# Altium schematic sheet electrical_interface.SchDoc: Electrical Interface
size A4; Author: AJ; DrawnBy: AJ; Engineer: AJ; DocumentNumber: 5; Revision: 005; SheetNumber: 5; SheetTotal: 6; Description: Interface to optocouplers on the external system.
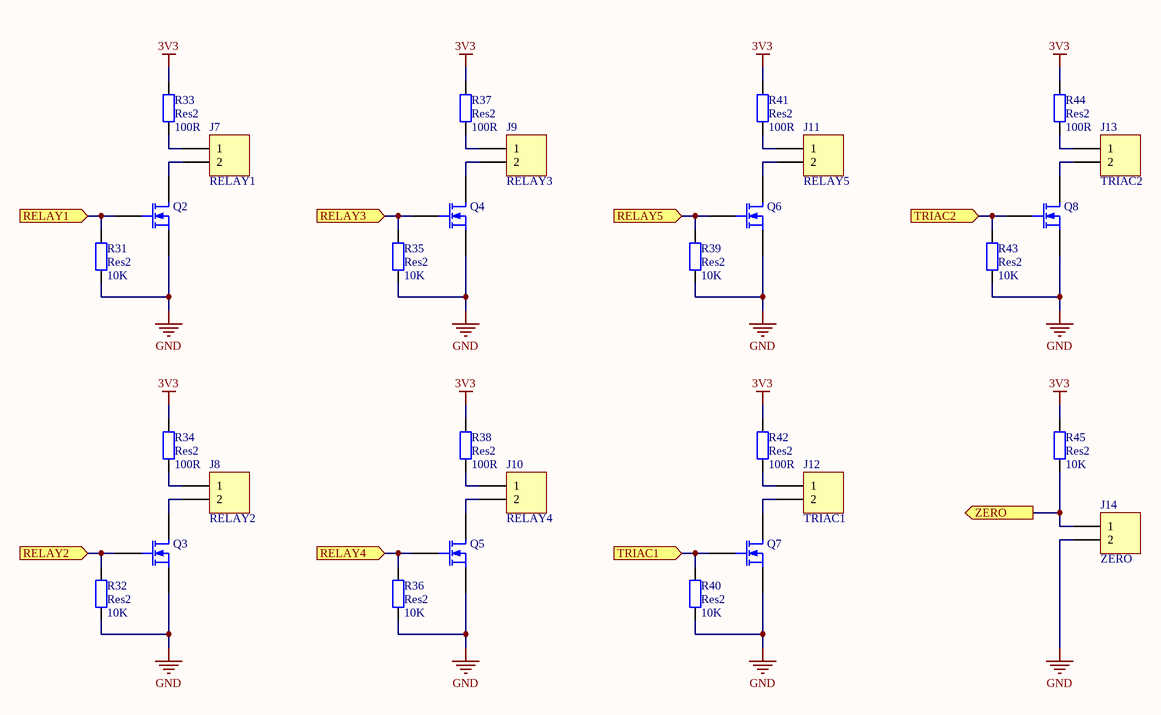
[diagram p0: electrical_interface.SchDoc]

## Parts
J7  RELAY1  [Terminal Block]
J8  RELAY2  [Terminal Block]
J9  RELAY3  [Terminal Block]
J10  RELAY4  [Terminal Block]
J11  RELAY5  [Terminal Block]
J12  TRIAC1  [Terminal Block]
J13  TRIAC2  [Terminal Block]
J14  ZERO  [Terminal Block]
Q2  MOSFET-N  [SOT323]  (value not drawn)
Q3  MOSFET-N  [SOT323]  (value not drawn)
Q4  MOSFET-N  [SOT323]  (value not drawn)
Q5  MOSFET-N  [SOT323]  (value not drawn)
Q6  MOSFET-N  [SOT323]  (value not drawn)
Q7  MOSFET-N  [SOT323]  (value not drawn)
Q8  MOSFET-N  [SOT323]  (value not drawn)
R31  Res2  value 10K  [0603]
R32  Res2  value 10K  [0603]
R33  Res2  value 100R  [0603]
R34  Res2  value 100R  [0603]
R35  Res2  value 10K  [0603]
R36  Res2  value 10K  [0603]
R37  Res2  value 100R  [0603]
R38  Res2  value 100R  [0603]
R39  Res2  value 10K  [0603]
R40  Res2  value 10K  [0603]
R41  Res2  value 100R  [0603]
R42  Res2  value 100R  [0603]
R43  Res2  value 10K  [0603]
R44  Res2  value 100R  [0603]
R45  Res2  value 10K  [0603]

## Ports
RELAY1 (in), RELAY2 (in), RELAY3 (in), RELAY4 (in), RELAY5 (in), TRIAC1 (in), TRIAC2 (in), ZERO (out)

## Nets
3V3: R33.2 R34.2 R37.2 R38.2 R41.2 R42.2 R44.2 R45.2
GND: J14.2 Q2.3(S) Q3.3(S) Q4.3(S) Q5.3(S) Q6.3(S) Q7.3(S) Q8.3(S) R31.1 R32.1 R35.1 R36.1 R39.1 R40.1 R43.1
RELAY1: Q2.2(G) R31.2 ; port RELAY1
RELAY2: Q3.2(G) R32.2 ; port RELAY2
RELAY3: Q4.2(G) R35.2 ; port RELAY3
RELAY4: Q5.2(G) R36.2 ; port RELAY4
RELAY5: Q6.2(G) R39.2 ; port RELAY5
TRIAC1: Q7.2(G) R40.2 ; port TRIAC1
TRIAC2: Q8.2(G) R43.2 ; port TRIAC2
ZERO: J14.1 R45.1 ; port ZERO
NetJ7_1: J7.1 R33.1
NetJ7_2: J7.2 Q2.1(D)
NetJ8_1: J8.1 R34.1
NetJ8_2: J8.2 Q3.1(D)
NetJ9_1: J9.1 R37.1
NetJ9_2: J9.2 Q4.1(D)
NetJ10_1: J10.1 R38.1
NetJ10_2: J10.2 Q5.1(D)
NetJ11_1: J11.1 R41.1
NetJ11_2: J11.2 Q6.1(D)
NetJ12_1: J12.1 R42.1
NetJ12_2: J12.2 Q7.1(D)
NetJ13_1: J13.1 R44.1
NetJ13_2: J13.2 Q8.1(D)

## Notes on the sheet
- TITLE
- DESCRIPTION
- SHEET
- of
- ENGINEER
- DATE
- REVISION
- AUTHOR
- FILE

## Library data of the parts
J7-J14 = Header 2: Header, 2-Pin; LatestRevisionDate: 17-Jul-2002; LatestRevisionNote: Re-released for DXP Platform.; Publisher: Altium Limited
Q2-Q8 = MOSFET-N: N-Channel MOSFET; Published: 8-Jun-2000; LatestRevisionDate: 17-Jul-2002; LatestRevisionNote: Re-released for DXP Platform.; PackageVersion: 1995/1996; PackageReference: E3; Publisher: Altium Limited
R31-R45 = Res2: Resistor; Published: 8-Jun-2000; LatestRevisionDate: 17-Jul-2002; LatestRevisionNote: Re-released for DXP Platform.; PackageReference: AXIAL-0.4; Publisher: Altium Limited